# Altium schematic sheet V1.0.SchDoc
size 152 x 76 mm
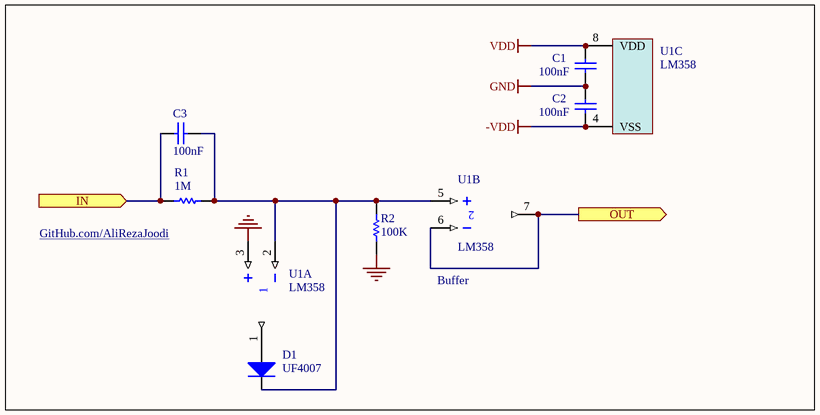
[diagram p0: V1.0.SchDoc]

## Parts
C1  100nF  [CAPNTO2.54-3.05x1.78A]
C2  100nF  [CAPNTO2.54-3.05x1.78A]
C3  100nF  [CAPNTO2.54-3.05x1.78A]
D1  UF4007  [DIODE-0.4]
R1  1M  [AXIAL-0.4]
R2  100K  [AXIAL-0.4]
U1  LM358  [DIP8]  (parts A,B,C of 3)

## Ports
IN (in), OUT (out)

## Nets
-VDD: C2.2 U1.4(VSS)
GND: C1.2 C2.1 R2.2 U1.3(IN+)
VDD: C1.1 U1.8(VDD)
IN: C3.2 R1.2 ; port IN
OUT: U1.6(IN-) U1.7(OUT) ; port OUT
NetC3_1: C3.1 D1.2(K) R1.1 R2.1 U1.2(IN-) U1.5(IN+)
NetD1_1: D1.1(A) U1.1(OUT)

## Notes on the sheet
- (near R1) GitHub.com/AliRezaJoodi
- Buffer

## Library data of the parts
C1-C3 = Cap: Capacitor; Manufacturer: Generic Components; Class I: Passive; Published: 8-Jun-2000; Revision: July-2002: Re-released for DXP Platform.; Publisher: Altium Limited; Class II: Capacitor
D1 = Diode: Default Diode; Manufacturer: Generic Components; Class I: Discrete; Class II: Diode - Switching; Published: 8-Jun-2000; Revision: July-2002: Re-released for DXP Platform.; Publisher: Altium Limited
R1 R2 = Res1: Resistor; Published: 8-Jun-2000; LatestRevisionDate: 17-Jul-2002; LatestRevisionNote: Re-released for DXP Platform.; PackageReference: AXIAL-0.3; Publisher: Altium Limited
U1 = LM358: Dual Low-Power Operational Amplifier; Published: 17-Jul-2002; LatestRevisionDate: 13-Apr-2006; LatestRevisionNote: IPC-7351 Footprint Added.; DatasheetVersion: 1988; PackageReference: 751-02; Publisher: Altium Limited; PackageDescription: 8-Pin Small Outline Integrated Circuit 1.27 mm Pitch; Code_JEDEC: MS-012-AA; Code_IPC: SOIC127P600-8; ComponentLink1Description: Manufacturer Link; ComponentLink1URL: http://www.onsemi.com/site/products/parametrics/0,4446,251,00.html; ComponentLink2Description: Datasheet; ComponentLink2URL: http://www.onsemi.com/pub/Collateral/LM358-D.PDF